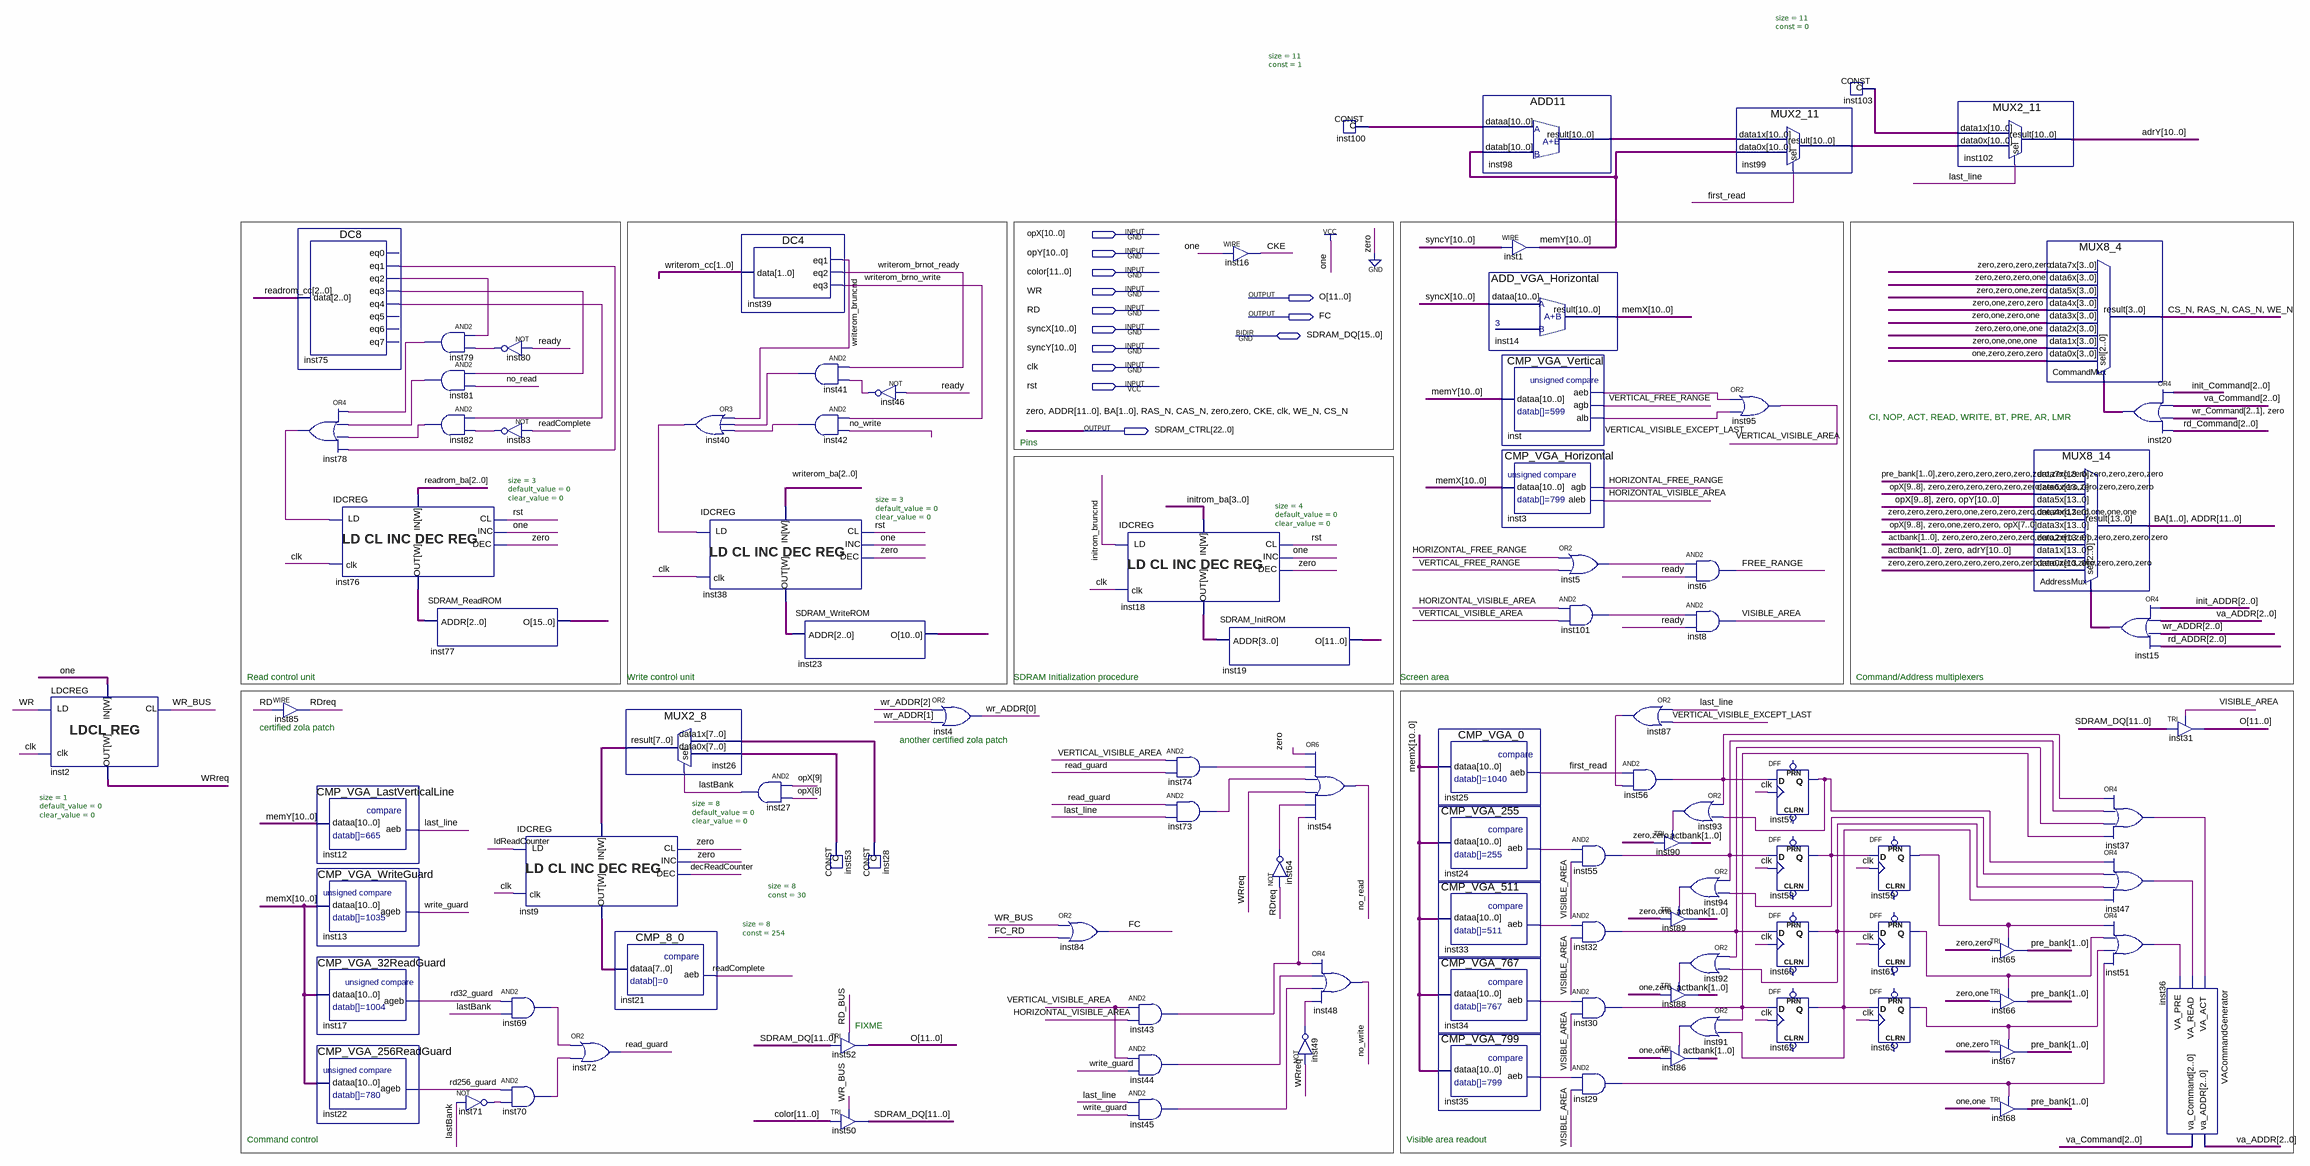
[diagram p0: schematic sheet]
// Quartus schematic MemorySequencer.bdf as structural Verilog: 101 symbols, 13 pins
module MemorySequencer (
  input  [10:0] opX,
  input  [10:0] opY,
  input  [11:0] color,
  input  WR,
  input  RD,
  input  [10:0] syncX,
  input  [10:0] syncY,
  input  clk,
  input  rst,
  inout  [15:0] SDRAM_DQ,
  output [11:0] O,
  output FC,
  output [22:0] SDRAM_CTRL
);

  wire decReadCounter, FC_RD, FC_WR, first_read, FREE_RANGE, HORIZONTAL_FREE_RANGE, HORIZONTAL_VISIBLE_AREA,
       initrom_bruncnd, inst5_out, inst24_aeb, inst29_out, inst30_out, inst32_out, inst33_aeb, inst34_aeb,
       inst35_aeb, inst37_out, inst40_out, inst41_out, inst42_out, inst43_out, inst44_out, inst45_out,
       inst46_out, inst47_out, inst49_out, inst51_out, inst55_out, inst56_out, inst57_q, inst58_q, inst59_q,
       inst60_q, inst61_q, inst62_q, inst63_q, inst64_out, inst69_out, inst70_out, inst71_out, inst73_out,
       inst74_out, inst75_eq1, inst75_eq2, inst75_eq3, inst75_eq4, inst78_out, inst79_out, inst80_out,
       inst81_out, inst82_out, inst83_out, inst87_out, inst91_out, inst92_out, inst93_out, inst94_out,
       inst101_out, inst_aeb, last_line, lastBank, ldReadCounter, no_read, no_write, rd32_guard, rd256_guard,
       RD_BUS, RDreq, read_guard, readComplete, ready, VERTICAL_FREE_RANGE, VERTICAL_VISIBLE_AREA,
       VERTICAL_VISIBLE_EXCEPT_LAST, VISIBLE_AREA, WR_BUS, write_guard, writerom_brno_write,
       writerom_brnot_ready, writerom_bruncnd, WRreq;
  wire [1:0] actbank, pre_bank, writerom_cc;
  wire [2:0] init_ADDR, init_Command, inst15_out, inst20_out, inst38_data_out, inst76_data_out, rd_ADDR,
       rd_Command, readrom_ba, readrom_cc, va_ADDR, va_Command, wr_ADDR, writerom_ba;
  wire [2:1] wr_Command;
  wire [3:0] initrom_ba, inst18_data_out;
  wire [7:0] inst9_data_out, inst26_result, inst28_data, inst53_data;
  wire [10:0] adrY, inst98_result, inst99_result, inst100_data, inst103_data, memX, memY;

  LDCREG #(.size(1), .default_value(0), .clear_value(0)) inst2 (
    .clk(clk), .data_in(1'b1), .cl(WR_BUS), .ld(WR), .data_out(WRreq));
  DC8 inst75 (
    .data(readrom_cc), .eq1(inst75_eq1), .eq2(inst75_eq2), .eq3(inst75_eq3), .eq4(inst75_eq4));  // open: eq0, eq5, eq6, eq7
  or inst78 (inst78_out, inst79_out, inst81_out, inst82_out, inst75_eq1);
  assign RDreq = RD;  // WIRE inst85
  IDCREG #(.size(3), .default_value(0), .clear_value(0)) inst76 (
    .clk(clk), .data_in(readrom_ba), .cl(rst), .inc(1'b1), .dec(1'b0), .ld(inst78_out),
    .data_out(inst76_data_out));
  CMP_VGA_LastVerticalLine inst12 (.dataa(memY), .aeb(last_line));
  CMP_VGA_WriteGuard inst13 (.dataa(memX), .ageb(write_guard));
  CMP_VGA_32ReadGuard inst17 (.dataa(memX), .ageb(rd32_guard));
  CMP_VGA_256ReadGuard inst22 (.dataa(memX), .ageb(rd256_guard));
  and inst79 (inst79_out, inst75_eq2, inst80_out);
  and inst81 (inst81_out, inst75_eq3, no_read);
  and inst82 (inst82_out, inst75_eq4, inst83_out);
  SDRAM_ReadROM inst77 (
    .ADDR(inst76_data_out),
    .O({readrom_ba, readrom_cc, rd_Command[2], decReadCounter, RD_BUS, FC_RD, ldReadCounter, rd_ADDR[1], rd_Command[0], rd_ADDR[0], rd_ADDR[2], rd_Command[1]}));
  not inst71 (inst71_out, lastBank);
  not inst80 (inst80_out, ready);
  not inst83 (inst83_out, readComplete);
  and inst69 (inst69_out, rd32_guard, lastBank);
  and inst70 (inst70_out, rd256_guard, inst71_out);
  IDCREG #(.size(8), .default_value(0), .clear_value(0)) inst9 (
    .clk(clk), .data_in(inst26_result), .cl(1'b0), .inc(1'b0), .dec(decReadCounter), .ld(ldReadCounter),
    .data_out(inst9_data_out));
  or inst72 (read_guard, inst69_out, inst70_out);
  MUX2_8 inst26 (.data1x(inst28_data), .data0x(inst53_data), .sel(lastBank), .result(inst26_result));
  CMP_8_0 inst21 (.dataa(inst9_data_out), .aeb(readComplete));
  or inst40 (inst40_out, writerom_bruncnd, inst41_out, inst42_out);
  IDCREG #(.size(3), .default_value(0), .clear_value(0)) inst38 (
    .clk(clk), .data_in(writerom_ba), .cl(rst), .inc(1'b1), .dec(1'b0), .ld(inst40_out),
    .data_out(inst38_data_out));
  DC4 inst39 (.data(writerom_cc), .eq1(writerom_bruncnd), .eq2(writerom_brnot_ready), .eq3(writerom_brno_write));
  and inst27 (lastBank, opX[9], opX[8]);
  and inst41 (inst41_out, writerom_brnot_ready, inst46_out);
  and inst42 (inst42_out, writerom_brno_write, no_write);
  SDRAM_WriteROM inst23 (
    .ADDR(inst38_data_out),
    .O({writerom_ba, writerom_cc, WR_BUS, wr_ADDR[1], wr_Command[2], FC_WR, wr_ADDR[2], wr_Command[1]}));
  CONST #(.size(8), .\const (30)) inst28 (.data(inst28_data));
  CONST #(.size(8), .\const (254)) inst53 (.data(inst53_data));
  TRI inst52[11:0] (.IN(SDRAM_DQ[11:0]), .OE(RD_BUS), .OUT(O));
  TRI inst50[11:0] (.IN(color), .OE(WR_BUS), .OUT(SDRAM_DQ[11:0]));
  not inst46 (inst46_out, ready);
  or inst4 (wr_ADDR[0], wr_ADDR[2], wr_ADDR[1]);
  or inst84 (FC, WR_BUS, FC_RD);
  IDCREG #(.size(4), .default_value(0), .clear_value(0)) inst18 (
    .clk(clk), .data_in(initrom_ba), .cl(rst), .inc(1'b1), .dec(1'b0), .ld(initrom_bruncnd),
    .data_out(inst18_data_out));
  and inst74 (inst74_out, VERTICAL_VISIBLE_AREA, read_guard);
  and inst73 (inst73_out, read_guard, last_line);
  and inst43 (inst43_out, VERTICAL_VISIBLE_AREA, HORIZONTAL_VISIBLE_AREA);
  and inst44 (inst44_out, VERTICAL_VISIBLE_AREA, write_guard);
  and inst45 (inst45_out, last_line, write_guard);
  SDRAM_InitROM inst19 (
    .ADDR(inst18_data_out),
    .O({initrom_ba, initrom_bruncnd, ready, init_ADDR[2], init_Command[1], init_ADDR[0], init_ADDR[1], init_Command[2], init_Command[0]}));
  assign SDRAM_CTRL[3] = 1'b1;  // WIRE inst16
  not inst64 (inst64_out, RDreq);
  or inst54 (no_read, 1'b0, inst74_out, inst73_out, WRreq, inst64_out, inst43_out);
  or inst48 (no_write, inst43_out, inst44_out, inst45_out, inst49_out);
  not inst49 (inst49_out, WRreq);
  CONST #(.size(11), .\const (1)) inst100 (.data(inst100_data));
  CMP_VGA_0 inst25 (.dataa(memX), .aeb(first_read));
  CMP_VGA_255 inst24 (.dataa(memX), .aeb(inst24_aeb));
  CMP_VGA_511 inst33 (.dataa(memX), .aeb(inst33_aeb));
  CMP_VGA_767 inst34 (.dataa(memX), .aeb(inst34_aeb));
  CMP_VGA_799 inst35 (.dataa(memX), .aeb(inst35_aeb));
  ADD11 inst98 (.dataa(inst100_data), .datab(memY), .result(inst98_result));
  assign memY = syncY;  // WIRE inst1
  ADD_VGA_Horizontal inst14 (.dataa(syncX), .result(memX));
  CMP_VGA_Vertical inst (.dataa(memY), .aeb(inst_aeb), .agb(VERTICAL_FREE_RANGE), .alb(VERTICAL_VISIBLE_EXCEPT_LAST));
  CMP_VGA_Horizontal inst3 (.dataa(memX), .agb(HORIZONTAL_FREE_RANGE), .aleb(HORIZONTAL_VISIBLE_AREA));
  or inst5 (inst5_out, HORIZONTAL_FREE_RANGE, VERTICAL_FREE_RANGE);
  and inst101 (inst101_out, HORIZONTAL_VISIBLE_AREA, VERTICAL_VISIBLE_AREA);
  and inst55 (inst55_out, inst24_aeb, VISIBLE_AREA);
  and inst32 (inst32_out, inst33_aeb, VISIBLE_AREA);
  and inst30 (inst30_out, inst34_aeb, VISIBLE_AREA);
  and inst29 (inst29_out, inst35_aeb, VISIBLE_AREA);
  or inst87 (inst87_out, last_line, VERTICAL_VISIBLE_EXCEPT_LAST);
  and inst56 (inst56_out, first_read, inst87_out);
  or inst93 (inst93_out, inst56_out, inst57_q);
  TRI inst90[1:0] (.IN(2'b00), .OE(inst93_out), .OUT(actbank));
  TRI inst89[1:0] (.IN(2'b01), .OE(inst94_out), .OUT(actbank));
  TRI inst88[1:0] (.IN(2'b10), .OE(inst92_out), .OUT(actbank));
  TRI inst86[1:0] (.IN(2'b11), .OE(inst91_out), .OUT(actbank));
  and inst6 (FREE_RANGE, inst5_out, ready);
  and inst8 (VISIBLE_AREA, inst101_out, ready);
  or inst94 (inst94_out, inst55_out, inst58_q);
  or inst92 (inst92_out, inst32_out, inst60_q);
  or inst91 (inst91_out, inst30_out, inst62_q);
  MUX2_11 inst99 (.data1x(inst98_result), .data0x(memY), .sel(first_read), .result(inst99_result));
  or inst95 (VERTICAL_VISIBLE_AREA, inst_aeb, VERTICAL_VISIBLE_EXCEPT_LAST);
  DFF inst57 (.CLK(clk), .D(inst56_out), .Q(inst57_q));  // open: CLRN, PRN
  DFF inst58 (.CLK(clk), .D(inst55_out), .Q(inst58_q));  // open: CLRN, PRN
  DFF inst60 (.CLK(clk), .D(inst32_out), .Q(inst60_q));  // open: CLRN, PRN
  DFF inst62 (.CLK(clk), .D(inst30_out), .Q(inst62_q));  // open: CLRN, PRN
  CONST #(.size(11), .\const (0)) inst103 (.data(inst103_data));
  DFF inst59 (.CLK(clk), .D(inst58_q), .Q(inst59_q));  // open: CLRN, PRN
  DFF inst61 (.CLK(clk), .D(inst60_q), .Q(inst61_q));  // open: CLRN, PRN
  DFF inst63 (.CLK(clk), .D(inst62_q), .Q(inst63_q));  // open: CLRN, PRN
  MUX2_11 inst102 (.data1x(inst103_data), .data0x(inst99_result), .sel(last_line), .result(adrY));
  TRI inst65[1:0] (.IN(2'b00), .OE(inst59_q), .OUT(pre_bank));
  TRI inst66[1:0] (.IN(2'b01), .OE(inst61_q), .OUT(pre_bank));
  TRI inst67[1:0] (.IN(2'b10), .OE(inst63_q), .OUT(pre_bank));
  TRI inst68[1:0] (.IN(2'b11), .OE(inst29_out), .OUT(pre_bank));
  MUX8_4 CommandMux (
    .data7x(4'b0000), .data6x(4'b0001), .data5x(4'b0010), .data4x(4'b0100), .data3x(4'b0101),
    .data2x(4'b0011), .data1x(4'b0111), .data0x(4'b1000), .sel(inst20_out),
    .result({SDRAM_CTRL[0], SDRAM_CTRL[7:6], SDRAM_CTRL[1]}));
  MUX8_14 AddressMux (
    .data7x({pre_bank, {12{1'b0}}}), .data6x({opX[9:8], {12{1'b0}}}), .data5x({opX[9:8], 1'b0, opY}),
    .data4x(14'b00001000100111), .data3x({opX[9:8], 4'b0100, opX[7:0]}), .data2x({actbank, {12{1'b0}}}),
    .data1x({actbank, 1'b0, adrY}), .data0x({14{1'b0}}), .sel(inst15_out),
    .result({SDRAM_CTRL[9:8], SDRAM_CTRL[21:10]}));
  assign inst20_out = init_Command | va_Command | {wr_Command, 1'b0} | rd_Command;  // OR4 inst20, 3 bits wide
  assign inst15_out = init_ADDR | va_ADDR | wr_ADDR | rd_ADDR;  // OR4 inst15, 3 bits wide
  or inst37 (inst37_out, inst56_out, inst55_out, inst32_out, inst30_out);
  or inst47 (inst47_out, inst57_q, inst58_q, inst60_q, inst62_q);
  or inst51 (inst51_out, inst59_q, inst61_q, inst63_q, inst29_out);
  TRI inst31[11:0] (.IN(SDRAM_DQ[11:0]), .OE(VISIBLE_AREA), .OUT(O));
  VACommandGenerator inst36 (
    .VA_ACT(inst37_out), .VA_READ(inst47_out), .VA_PRE(inst51_out), .va_ADDR(va_ADDR), .va_Command(va_Command));

  assign {SDRAM_CTRL[22], SDRAM_CTRL[5:4], SDRAM_CTRL[2]} = {3'b000, clk};

  // Other names for the same wires on the sheet: ADDR[11:0] = SDRAM_CTRL[21:10]; BA[1:0] = SDRAM_CTRL[9:8];
  //   CAS_N = SDRAM_CTRL[6]; CKE = SDRAM_CTRL[3]; CS_N = SDRAM_CTRL[0]; RAS_N = SDRAM_CTRL[7]; WE_N = SDRAM_CTRL[1]

  // Notes on the sheet:
  //   CI, NOP, ACT, READ, WRITE, BT, PRE, AR, LMR
  //   Pins
  //   Read control unit
  //   Write control unit
  //   SDRAM Initialization procedure
  //   Screen area
  //   Command/Address multiplexers
  //   certified zola patch
  //   another certified zola patch
  //   FIXME
  //   Command control
  //   Visible area readout
endmodule
